# EAGLE design entree16_v1_4_4 (EAGLE 5.10)
DRILL: 1.6mm
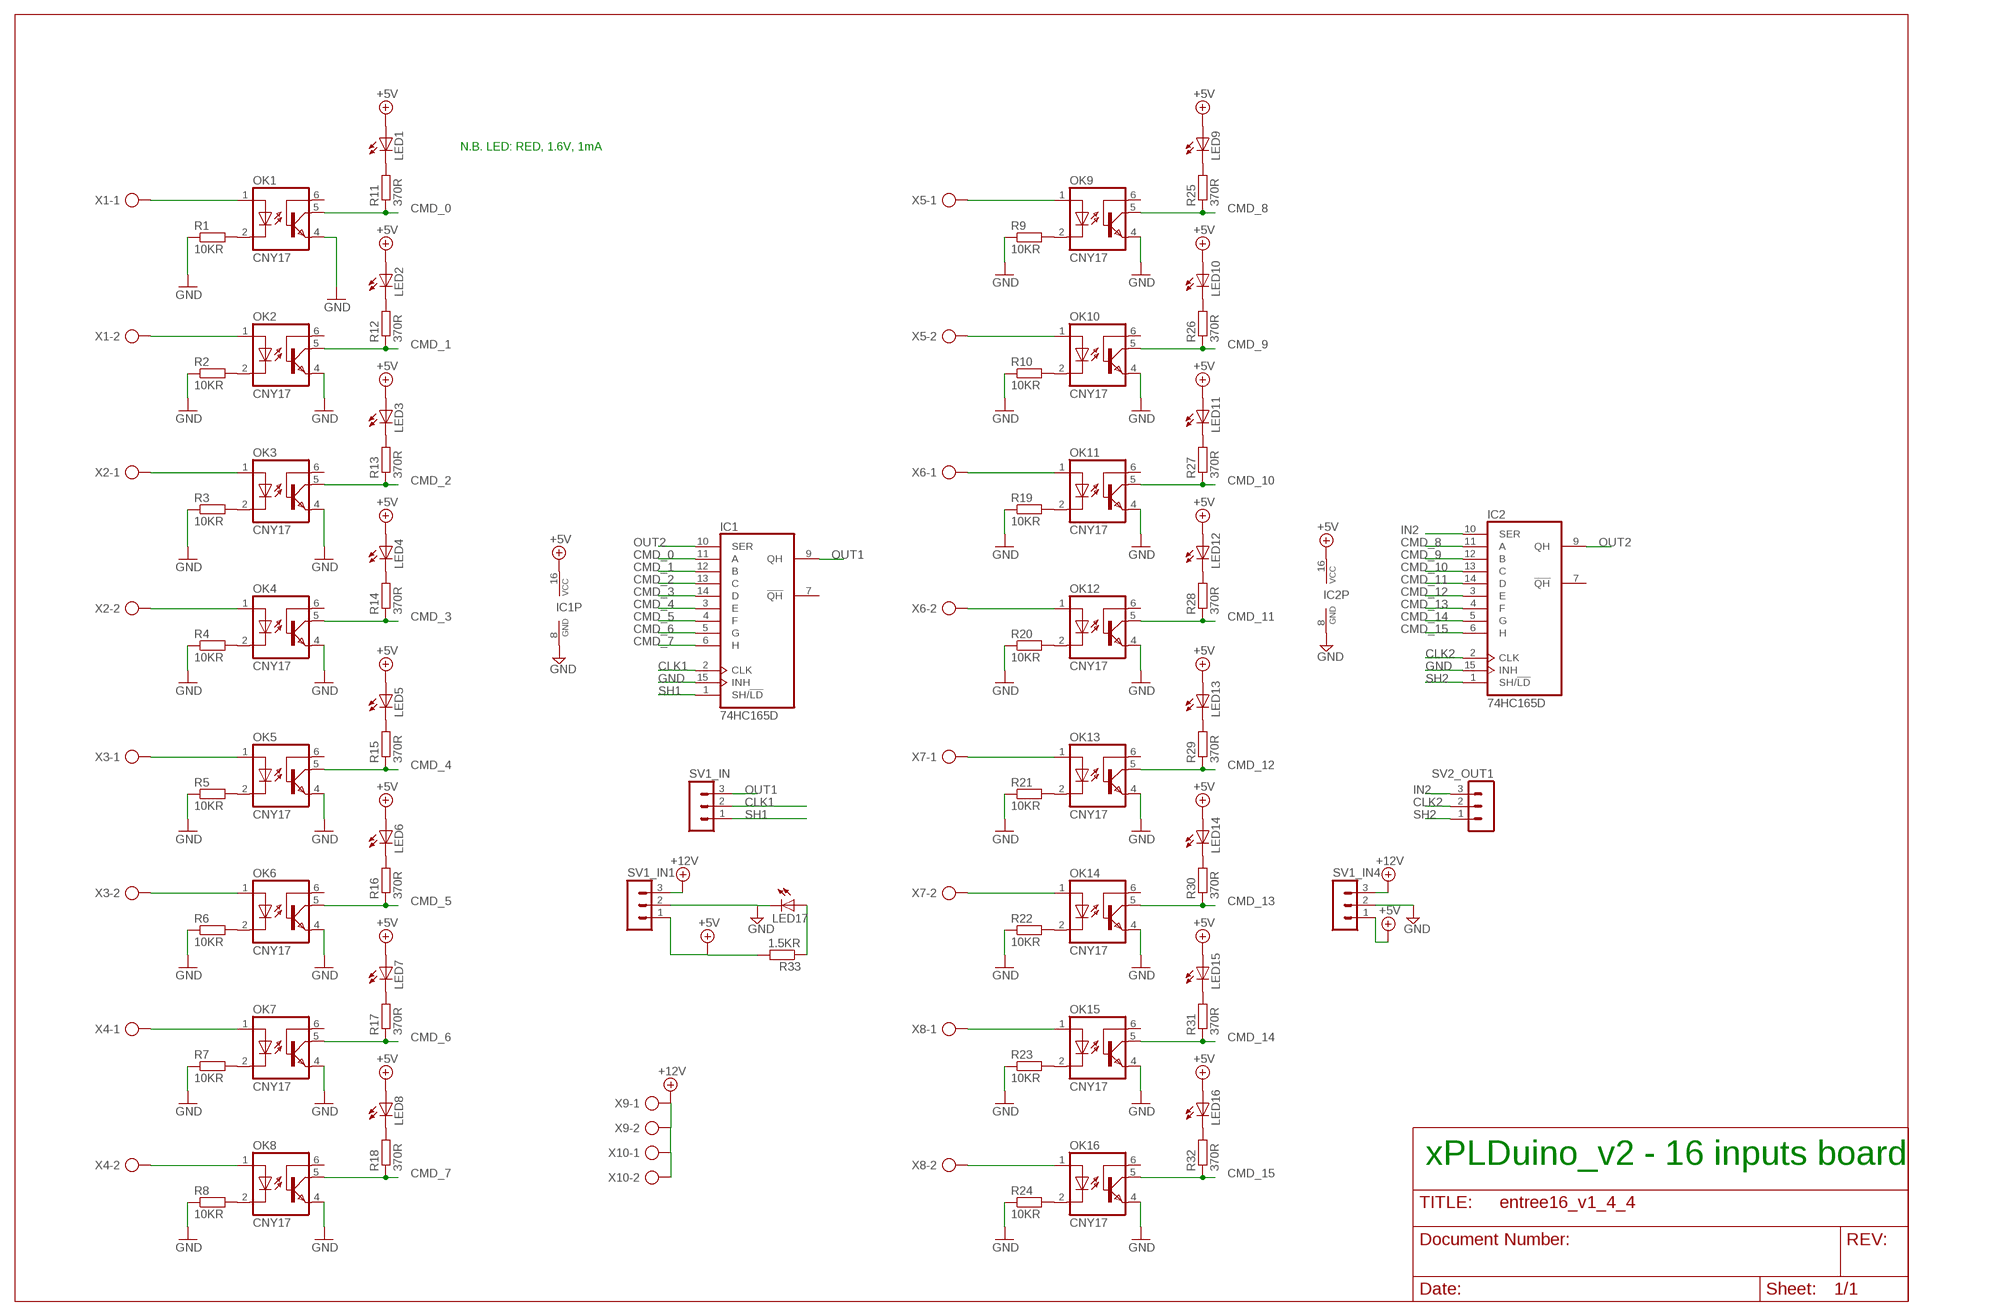
[diagram p0: schematic, sheet 1]

## Parts
IC1  74HC165D  [SO16]
IC2  74HC165D  [SO16]
LED1  LED3MM  [LED3MM]
LED2  LED3MM  [LED3MM]
LED3  LED3MM  [LED3MM]
LED4  LED3MM  [LED3MM]
LED5  LED3MM  [LED3MM]
LED6  LED3MM  [LED3MM]
LED7  LED3MM  [LED3MM]
LED8  LED3MM  [LED3MM]
LED9  LED3MM  [LED3MM]
LED10  LED3MM  [LED3MM]
LED11  LED3MM  [LED3MM]
LED12  LED3MM  [LED3MM]
LED13  LED3MM  [LED3MM]
LED14  LED3MM  [LED3MM]
LED15  LED3MM  [LED3MM]
LED16  LED3MM  [LED3MM]
LED17  LED3MM  [LED3MM]
OK1  CNY17  [DIL06]
OK2  CNY17  [DIL06]
OK3  CNY17  [DIL06]
OK4  CNY17  [DIL06]
OK5  CNY17  [DIL06]
OK6  CNY17  [DIL06]
OK7  CNY17  [DIL06]
OK8  CNY17  [DIL06]
OK9  CNY17  [DIL06]
OK10  CNY17  [DIL06]
OK11  CNY17  [DIL06]
OK12  CNY17  [DIL06]
OK13  CNY17  [DIL06]
OK14  CNY17  [DIL06]
OK15  CNY17  [DIL06]
OK16  CNY17  [DIL06]
R1  10KR  R-EU_0204/7  [0204/7]
R2  10KR  R-EU_0204/7  [0204/7]
R3  10KR  R-EU_0204/7  [0204/7]
R4  10KR  R-EU_0204/7  [0204/7]
R5  10KR  R-EU_0204/7  [0204/7]
R6  10KR  R-EU_0204/7  [0204/7]
R7  10KR  R-EU_0204/7  [0204/7]
R8  10KR  R-EU_0204/7  [0204/7]
R9  10KR  R-EU_0204/7  [0204/7]
R10  10KR  R-EU_0204/7  [0204/7]
R11  370R  R-EU_0204/7  [0204/7]
R12  370R  R-EU_0204/7  [0204/7]
R13  370R  R-EU_0204/7  [0204/7]
R14  370R  R-EU_0204/7  [0204/7]
R15  370R  R-EU_0204/7  [0204/7]
R16  370R  R-EU_0204/7  [0204/7]
R17  370R  R-EU_0204/7  [0204/7]
R18  370R  R-EU_0204/7  [0204/7]
R19  10KR  R-EU_0204/7  [0204/7]
R20  10KR  R-EU_0204/7  [0204/7]
R21  10KR  R-EU_0204/7  [0204/7]
R22  10KR  R-EU_0204/7  [0204/7]
R23  10KR  R-EU_0204/7  [0204/7]
R24  10KR  R-EU_0204/7  [0204/7]
R25  370R  R-EU_0204/7  [0204/7]
R26  370R  R-EU_0204/7  [0204/7]
R27  370R  R-EU_0204/7  [0204/7]
R28  370R  R-EU_0204/7  [0204/7]
R29  370R  R-EU_0204/7  [0204/7]
R30  370R  R-EU_0204/7  [0204/7]
R31  370R  R-EU_0204/7  [0204/7]
R32  370R  R-EU_0204/7  [0204/7]
R33  1.5KR  R-EU_0204/5  [0204/5]
SV1_IN  MA03-1  [MA03-1]
SV1_IN1  MA03-1  [MA03-1]
SV1_IN4  MA03-1  [MA03-1]
SV2_OUT1  MA03-1  [MA03-1]
X1  AK500/2-H  [AK500/2-H]
X2  AK500/2-H  [AK500/2-H]
X3  AK500/2-H  [AK500/2-H]
X4  AK500/2-H  [AK500/2-H]
X5  AK500/2-H  [AK500/2-H]
X6  AK500/2-H  [AK500/2-H]
X7  AK500/2-H  [AK500/2-H]
X8  AK500/2-H  [AK500/2-H]
X9  AK500/2-H  [AK500/2-H]
X10  AK500/2-H  [AK500/2-H]

## Nets
+5V: IC1.16(VCC) IC2.16(VCC) LED1.A LED2.A LED3.A LED4.A LED5.A LED6.A LED7.A LED8.A LED9.A LED10.A LED11.A LED12.A LED13.A LED14.A LED15.A LED16.A R33.2 SV1_IN1.1 SV1_IN4.1
+12V: SV1_IN1.3 SV1_IN4.3 X9.1 X9.2 X10.1 X10.2
CLK1: IC1.2(CLK) SV1_IN.2
CLK2: IC2.2(CLK) SV2_OUT1.2
CMD_0: IC1.11(A) OK1.5(COL) R11.1
CMD_1: IC1.12(B) OK2.5(COL) R12.1
CMD_2: IC1.13(C) OK3.5(COL) R13.1
CMD_3: IC1.14(D) OK4.5(COL) R14.1
CMD_4: IC1.3(E) OK5.5(COL) R15.1
CMD_5: IC1.4(F) OK6.5(COL) R16.1
CMD_6: IC1.5(G) OK7.5(COL) R17.1
CMD_7: IC1.6(H) OK8.5(COL) R18.1
CMD_8: IC2.11(A) OK9.5(COL) R25.1
CMD_9: IC2.12(B) OK10.5(COL) R26.1
CMD_10: IC2.13(C) OK11.5(COL) R27.1
CMD_11: IC2.14(D) OK12.5(COL) R28.1
CMD_12: IC2.3(E) OK13.5(COL) R29.1
CMD_13: IC2.4(F) OK14.5(COL) R30.1
CMD_14: IC2.5(G) OK15.5(COL) R31.1
CMD_15: IC2.6(H) OK16.5(COL) R32.1
GND: IC1.8(GND) IC1.15(INH) IC2.8(GND) IC2.15(INH) LED17.K(C) OK1.4(EMI) OK2.4(EMI) OK3.4(EMI) OK4.4(EMI) OK5.4(EMI) OK6.4(EMI) OK7.4(EMI) OK8.4(EMI) OK9.4(EMI) OK10.4(EMI) OK11.4(EMI) OK12.4(EMI) OK13.4(EMI) OK14.4(EMI) OK15.4(EMI) OK16.4(EMI) R1.1 R2.1 R3.1 R4.1 R5.1 R6.1 R7.1 R8.1 R9.1 R10.1 R19.1 R20.1 R21.1 R22.1 R23.1 R24.1 SV1_IN1.2 SV1_IN4.2
IN2: IC2.10(SER) SV2_OUT1.3
N$1: LED1.K(C) R11.2
N$2: LED2.K(C) R12.2
N$3: OK1.2(C) R1.2
N$4: OK2.2(C) R2.2
N$5: LED3.K(C) R13.2
N$6: LED4.K(C) R14.2
N$7: LED5.K(C) R15.2
N$8: LED6.K(C) R16.2
N$9: OK3.2(C) R3.2
N$10: OK8.1(A) X4.2
N$11: OK7.1(A) X4.1
N$12: OK4.2(C) R4.2
N$13: OK6.1(A) X3.2
N$14: OK5.1(A) X3.1
N$15: OK5.2(C) R5.2
N$16: OK6.2(C) R6.2
N$17: OK4.1(A) X2.2
N$18: OK3.1(A) X2.1
N$19: LED7.K(C) R17.2
N$20: OK2.1(A) X1.2
N$21: OK7.2(C) R7.2
N$22: OK8.2(C) R8.2
N$23: LED8.K(C) R18.2
N$24: OK1.1(A) X1.1
N$27: OK9.2(C) R9.2
N$28: OK10.2(C) R10.2
N$29: OK11.2(C) R19.2
N$30: OK12.2(C) R20.2
N$31: OK13.2(C) R21.2
N$32: OK14.2(C) R22.2
N$33: OK15.2(C) R23.2
N$34: OK16.2(C) R24.2
N$35: LED9.K(C) R25.2
N$36: LED10.K(C) R26.2
N$37: LED11.K(C) R27.2
N$38: LED12.K(C) R28.2
N$39: LED13.K(C) R29.2
N$40: LED14.K(C) R30.2
N$41: OK16.1(A) X8.2
N$42: OK15.1(A) X8.1
N$43: OK14.1(A) X7.2
N$44: OK13.1(A) X7.1
N$45: OK12.1(A) X6.2
N$46: OK11.1(A) X6.1
N$47: LED15.K(C) R31.2
N$48: OK10.1(A) X5.2
N$49: LED16.K(C) R32.2
N$50: OK9.1(A) X5.1
N$51: LED17.A R33.1
OUT1: IC1.9(QH) SV1_IN.3
OUT2: IC1.10(SER) IC2.9(QH)
SH1: IC1.1(SH/!LD) SV1_IN.1
SH2: IC2.1(SH/!LD) SV2_OUT1.1
Unconnected: IC1.7(!QH) IC2.7(!QH) OK1.6(BAS) OK2.6(BAS) OK3.6(BAS) OK4.6(BAS) OK5.6(BAS) OK6.6(BAS) OK7.6(BAS) OK8.6(BAS) OK9.6(BAS) OK10.6(BAS) OK11.6(BAS) OK12.6(BAS) OK13.6(BAS) OK14.6(BAS) OK15.6(BAS) OK16.6(BAS)

## Notes on the sheet
- N.B. LED: RED, 1.6V, 1mA
- xPLDuino_v2 - 16 inputs board

## Library data of the parts
IC1 IC2 = 74xx-eu:74*165: 8-bit parallel load SHIFT REGISTER
LED1-LED17 = led:LED: LED OSRAM: - CHIPLED LG R971, LG N971, LY N971, LG Q971, LY Q971, LO R971, LY R971 LH N974, LH R974 LS Q976, LO Q976, LY Q976 LO Q996 - Hyper CHIPLED LW Q18S LB Q993, LB Q99A, LB R99A - SideLED LS A670, LO A670, LY A670, LG A670, LP A670 LB A673, LV A673, LT A673, LW A673 LH A674 LY A675 LS A676, LA A676, LO A676, LY A676, LW A676 LS A679, LY A679, LG A679 - Hyper Micro SIDELED® LS Y876, LA Y876, LO Y876, LY Y876 LT Y87S - SmartLED LW L88C, LW L88S LB L89C, LB L89S, LG L890 LS L89K, LO L89K, LY L89K LS L896, LA L896, LO L896, LY L896 - TOPLED LS T670, LO T670, LY T670, LG T670, LP T670 LSG T670, LSP T670, LSY T670, LOP T670, LYG T670 LG T671, LOG T671, LSG T671 LB T673, LV T673, LT T673, LW T673 LH T674 LS T676, LA T676, LO T676, LY T676, LB T676, LH T676, LSB T676, LW T676 LB T67C, LV T67C, LT T67C, LS T67K, LO T67K, LY T67K, LW E67C LS E67B, LA E67B, LO E67B, LY E67B, LB E67C, LV E67C, LT E67C LW T67C LS T679, LY T679, LG T679 LS T770, LO T770, LY T770, LG T770, LP T770 LB T773, LV T773, LT T773, LW T773 LH T774 LS E675, LA E675, LY E675, LS T675 LS T776, LA T776, LO T776, LY T776, LB T776 LHGB T686 LT T68C, LB T68C - Hyper Mini TOPLED® LB M676 - Mini TOPLED Santana® LG M470 LS M47K, LO M47K, LY M47K Source: http://www.osram.convergy.de LUXEON: - LUMILED® LXK2-PW12-R00, LXK2-PW12-S00, LXK2-PW14-U00, LXK2-PW14-V00 LXK2-PM12-R00, LXK2-PM12-S00, LXK2-PM14-U00 LXK2-PE12-Q00, LXK2-PE12-R00, LXK2-PE12-S00, LXK2-PE14-T00, LXK2-PE14-U00 LXK2-PB12-K00, LXK2-PB12-L00, LXK2-PB12-M00, LXK2-PB14-N00, LXK2-PB14-P00, LXK2-PB14-Q00 LXK2-PR12-L00, LXK2-PR12-M00, LXK2-PR14-Q00, LXK2-PR14-R00 LXK2-PD12-Q00, LXK2-PD12-R00, LXK2-PD12-S00 LXK2-PH12-R00, LXK2-PH12-S00 LXK2-PL12-P00, LXK2-PL12-Q00, LXK2-PL12-R00 Source: www.luxeon.com KINGBRIGHT: KA-3528ASYC Source: www.kingbright.com
OK1-OK16 = optocoupler:CNY17: SIEMENS OPTO COUPLER
R1-R33 = resistor:R-EU_: RESISTOR, European symbol
SV1_IN SV1_IN1 SV1_IN4 SV2_OUT1 = con-lstb:MA03-1: PIN HEADER; OC_FARNELL: unknown; OC_NEWARK: unknown
X1-X10 = con-ptr500:AK500/2-H: CONNECTOR Aug. 2004 / PTR Meßtechnik: Die Bezeichnung der Serie AK505 wurde geändert. Es handelt sich hierbei um AK500 in horizontaler Ausführung.; OC_FARNELL: unknown; OC_NEWARK: unknown

## Net classes
1 puissance: width 0.254 mm, drill 0.61 mm

## Board
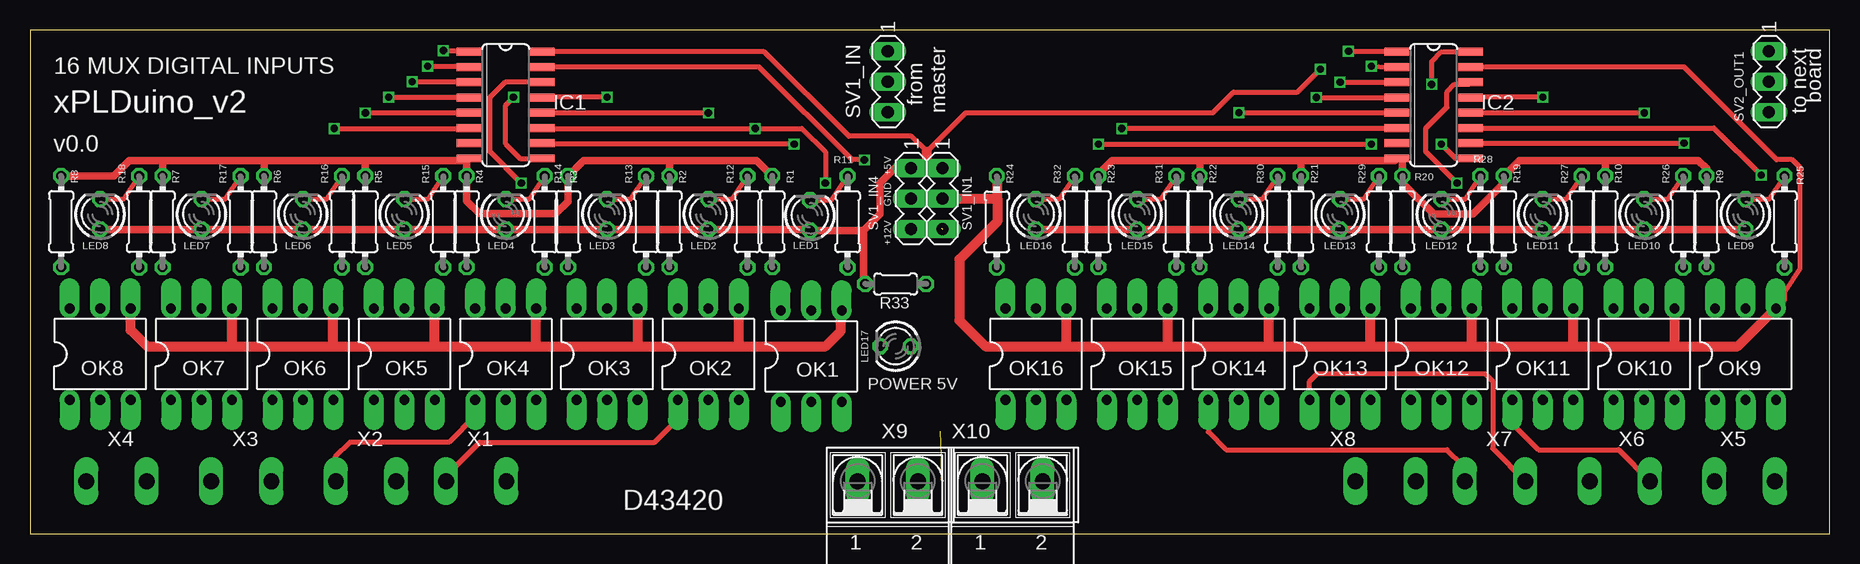
[diagram p1: board, top side]
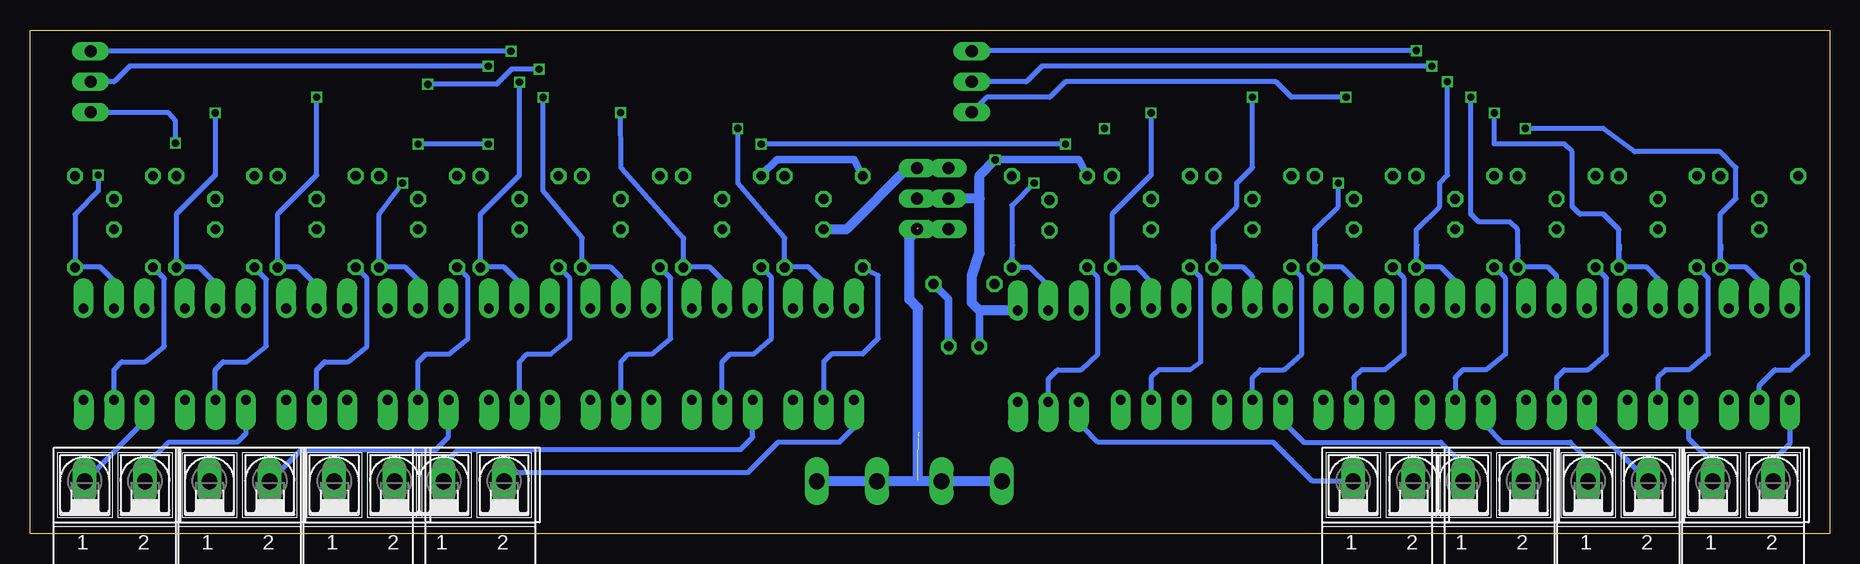
[diagram p2: board, bottom side, seen from below]

Size 150 x 42 mm. Coordinates in mm from the lower left corner, seen from the top.
Outline: 0,0 150,0 150,42 0,42 0,0
Copper layers (1*16): Top 0.035mm / dielectric 1.5mm / Bottom 0.035mm
Design rules "Fusion_eagle_rule_v1.1": minimum track width 6mil, minimum drill 12mil, track to track 6mil, track to pad 6mil, pad to pad 6mil, via to via 6mil, smd to smd 0mil, copper to edge 10mil, drill to drill 10mil, minimum pad ring 10mil, minimum via ring 6mil, stop-mask expansion 2mil, vias tented up to drill 100mil, thermal gap 10mil

### Footprints (pad centres in the part's own frame; a part is rotated, then mirrored left to right if it is on the bottom)
SO16 = smd 0.66 x 2.032: 1 -4.445,-3.073; 2 -3.175,-3.073; 3 -1.905,-3.073; 4 -0.635,-3.073; 5 0.635,-3.073; 6 1.905,-3.073; 7 3.175,-3.073; 8 4.445,-3.073; 9 4.445,3.073; 10 3.175,3.073; 11 1.905,3.073; 12 0.635,3.073; 13 -0.635,3.073; 14 -1.905,3.073; 15 -3.175,3.073; 16 -4.445,3.073
LED3MM = drill 0.813 octagon: A -1.27,0; K 1.27,0
DIL06 = drill 0.813 pad 1.676 offset: 1 -2.54,-3.81; 2 0,-3.81; 3 2.54,-3.81; 4 2.54,3.81; 5 0,3.81; 6 -2.54,3.81
0204/7 = drill 0.813 octagon: 1 -3.81,0; 2 3.81,0
0204/5 = drill 0.813 octagon: 1 -2.54,0; 2 2.54,0
MA03-1 = drill 1.016 long: 1 -2.54,0; 2 0,0; 3 2.54,0
AK500/2-H = drill 1.321 long: 1 -2.515,0; 2 2.515,0

### Placement (x,y rotation side)
IC1  39.65,35.73 270 top
IC2  117,35.73 270 top
LED1  65.02,26.55 90 top
LED2  56.55,26.64 90 top
LED3  48.1,26.64 90 top
LED4  39.65,26.64 90 top
LED5  31.2,26.64 90 top
LED6  22.75,26.64 90 top
LED7  14.3,26.64 90 top
LED8  5.85,26.64 90 top
LED9  143,26.64 90 top
LED10  134.55,26.64 90 top
LED11  126.1,26.64 90 top
LED12  117.65,26.64 90 top
LED13  109.2,26.64 90 top
LED14  100.75,26.64 90 top
LED15  92.3,26.64 90 top
LED16  83.85,26.64 90 top
LED17  72.15,15.62 180 top
OK1  65.12,14.79 0 top
OK2  56.55,14.96 0 top
OK3  48.1,14.96 0 top
OK4  39.65,14.96 0 top
OK5  31.2,14.96 0 top
OK6  22.75,14.96 0 top
OK7  14.3,14.96 0 top
OK8  5.85,14.96 0 top
OK9  143,14.96 0 top
OK10  134.55,14.96 0 top
OK11  126.1,14.96 0 top
OK12  117.65,14.96 0 top
OK13  109.2,14.96 0 top
OK14  100.75,14.96 0 top
OK15  92.3,14.96 0 top
OK16  83.85,14.96 0 top
R1  61.87,26.02 270 top
R2  53.3,26.02 270 top
R3  44.85,26.02 270 top
R4  36.4,26.02 270 top
R5  27.95,26.02 270 top
R6  19.5,26.02 270 top
R7  11.05,26.02 270 top
R8  2.6,26.02 270 top
R9  139.75,26.02 270 top
R10  131.3,26.02 270 top
R11  68.16,26 90 top
R12  59.8,26 90 top
R13  51.35,26 90 top
R14  42.9,26 90 top
R15  34.45,26 90 top
R16  26,26 90 top
R17  17.55,26 90 top
R18  9.1,26 90 top
R19  122.85,26.02 270 top
R20  114.4,26.02 270 top
R21  105.95,26.02 270 top
R22  97.5,26.02 270 top
R23  89.05,26.02 270 top
R24  80.58,26 270 top
R25  146.25,26 90 top
R26  137.8,26 90 top
R27  129.35,26 90 top
R28  120.9,26 90 top
R29  112.45,26 90 top
R30  104,26 90 top
R31  95.55,26 90 top
R32  87.1,26 90 top
R33  72.15,20.82 180 top
SV1_IN  71.5,37.69 270 top
SV1_IN1  76.05,27.93 270 top
SV1_IN4  73.45,27.93 270 top
SV2_OUT1  144.95,37.69 270 top
X1  37.19,4.37 0 bottom
X2  28.01,4.37 0 bottom
X3  17.61,4.37 0 bottom
X4  7.21,4.37 0 bottom
X5  142.93,4.37 0 bottom
X6  132.53,4.37 0 bottom
X7  122.12,4.37 0 bottom
X8  113,4.37 0 bottom
X9  71.5,4.37 0 top
X10  81.9,4.37 0 top

### Tracks (layer width: path | path; a pad name or v marks a point on that pad's centre or on a via)
+5V  (via drill 0.6)
  Top 0.406: IC1.16 61.2,40.18 68.25,33.13 73.45,33.13 74.75,31.84 78,35.09 98.58,35.09 100.33,36.83 105.66,36.83 v107.56,38.73 | IC2.16 117.65,40.18 116.84,39.37 v116.84,37.47
  Top 0.61: 69.49,25.27 LED1.A arc90 64.93,25.36 LED2.A LED3.A LED4.A LED5.A LED6.A LED7.A LED8.A | 69.49,25.27 70.85,26.64 70.85,29.23 72.15,30.54 73.39,30.54 SV1_IN4.1 | SV1_IN1.1 76.11,30.54 | 69.49,25.27 69.49,20.93 R33.2 | LED16.A LED15.A LED14.A LED13.A LED12.A LED11.A LED10.A LED9.A
  Top 0.813: SV1_IN4.1 74.75,30.48 | 74.75,30.48 SV1_IN1.1 | 74.75,30.48 74.75,31.84
  Bottom 0.406: v107.56,38.73 109.86,38.73 111.12,37.47 v116.84,37.47
  Bottom 0.813: LED16.A 81.95,25.36 76.83,30.48 SV1_IN1.1
+12V  (3 unrouted)
  Bottom 0.61: 76.05,4.37 75.97,4.45
  Bottom 0.813: X9.1 X9.2 76.05,4.37 X10.1 X10.2 | SV1_IN4.3 SV1_IN1.3 | 75.97,25.48 75.97,25.42 76.7,24.68 76.7,19.52 75.97,18.78 75.97,4.45
CLK1  (via drill 0.6)
  Top 0.406: v33.15,38.98 36.5,38.98 IC1.2
  Bottom 0.406: v33.15,38.98 65.65,38.98 66.95,37.69 SV1_IN.2
CLK2  (via drill 0.6)
  Top 0.406: IC2.2 113.17,38.91 v111.8,38.98
  Bottom 0.406: v111.8,38.98 141.7,38.98 143,37.69 SV2_OUT1.2
CMD_0  (via drill 0.6)
  Top 0.406: v66.3,29.23 66.3,31.84 64.35,33.78 v60.45,33.78 42.77,33.78 IC1.11
  Bottom 0.406: 66.3,29.09 v66.3,29.23 68.16,27.38 R11.1 | R11.1 68.1,24.04 | OK1.5 65.12,20.67 66.67,22.23 68.12,22.23 R11.1
CMD_1  (via drill 0.6)
  Top 0.406: v56.55,35.09 42.74,35.09 IC1.12
  Bottom 0.406: v56.55,35.09 56.55,29.89 59.8,26.64 R12.1 57.75,22.19 56.52,20.95 56.52,18.81 OK2.5
CMD_2  (via drill 0.6)
  Top 0.406: v48.1,36.38 42.74,36.38 IC1.13
  Bottom 0.406: R13.1 51.35,25.34 49.4,27.29 49.4,29.23 48.1,30.54 v48.1,36.38 | R13.1 51.29,24.04 | OK3.5 48.1,21.43 48.9,22.23 51.31,22.23 R13.1
CMD_3  (via drill 0.6)
  Top 0.406: IC1.14 42.68,37.69 39.65,37.69 38.35,36.38 38.35,31.84 v40.95,29.23
  Bottom 0.406: R14.1 42.9,25.34 40.95,27.29 v40.95,29.23 | R14.1 42.84,24.04 | OK4.5 39.65,21.23 40.64,22.23 42.87,22.23 R14.1
CMD_4  (via drill 0.6)
  Top 0.406: v31.85,37.69 36.53,37.69 IC1.3
  Bottom 0.406: R15.1 34.45,25.34 32.5,27.29 32.5,29.23 31.85,29.89 v31.85,37.69 | R15.1 34.39,24.04 | OK5.5 31.2,21.04 32.38,22.23 34.41,22.23 R15.1
CMD_5  (via drill 0.6)
  Top 0.406: v29.9,36.38 36.56,36.38 IC1.4
  Bottom 0.406: v29.9,36.38 29.9,26.64 29.25,25.98 26.65,25.98 26,25.34 R16.1 | R16.1 25.94,24.04 | OK6.5 22.75,21.48 23.5,22.23 25.96,22.23 R16.1
CMD_6  (via drill 0.6)
  Top 0.406: v27.95,35.09 36.58,35.09 IC1.5
  Bottom 0.406: R17.1 17.55,25.34 18.85,26.64 20.8,26.64 21.45,27.29 21.45,31.84 22.1,32.48 27.95,32.48 v27.95,35.09 | R17.1 17.49,24.04 | OK7.5 14.3,21.29 15.24,22.23 17.52,22.23 R17.1
CMD_7  (via drill 0.6)
  Top 0.406: v25.35,33.78 36.53,33.78 IC1.6
  Bottom 0.406: R18.1 9.1,26.64 7.8,27.93 7.8,30.54 9.1,31.84 16.25,31.84 18.85,33.78 v25.35,33.78 | R18.1 9.04,24.04 | OK8.5 5.85,21.09 6.99,22.23 9.06,22.23 R18.1
CMD_8  (via drill 0.6)
  Top 0.406: IC2.11 140.35,33.83 v144.3,29.89
  Bottom 0.406: v144.3,29.89 144.3,28.59 146.25,26.64 R25.1 146.22,22.23 144.15,22.23 143,21.08 OK9.5
CMD_9  (via drill 0.6)
  Top 0.406: v134.55,35.09 120.09,35.09 IC2.12
  Bottom 0.406: v134.55,35.09 134.55,29.89 137.8,26.64 R26.1 137.76,22.23 135.89,22.23 134.55,20.89 OK10.5
CMD_10  (via drill 0.6)
  Top 0.406: v126.1,36.38 120.06,36.38 | 120.06,36.38 119.6,36.38 | 120.06,36.38 IC2.13
  Bottom 0.406: v126.1,36.38 126.1,29.89 129.35,26.64 R27.1 129.31,22.23 127.64,22.23 126.1,20.69 OK11.5
CMD_11  (via drill 0.6)
  Top 0.406: v118.95,29.23 116.35,31.84 116.35,33.8 118.11,35.56 118.11,36.83 118.75,37.47 119.9,37.47 IC2.14 120.03,37.69
  Bottom 0.406: v118.95,29.23 120.9,26.64 R28.1 120.86,22.23 118.75,22.23 117.65,21.13 OK12.5
CMD_12  (via drill 0.6)
  Top 0.406: v109.2,37.64 IC2.3
  Bottom 0.406: v109.2,37.64 109.2,29.89 112.45,26.64 R29.1 112.42,22.23 110.49,22.23 109.2,20.93 OK13.5
CMD_13  (via drill 0.6)
  Top 0.406: v107.23,36.37 IC2.4
  Bottom 0.406: v107.23,36.37 107.25,31.18 107.25,28.59 104,24.68 103.97,24.65 103.97,22.23 | OK14.5 100.75,21.38 101.6,22.23 103.97,22.23 | 103.97,22.23 R30.1
CMD_14  (via drill 0.6)
  Top 0.406: v100.77,35.1 IC2.5
  Bottom 0.406: v100.77,35.1 100.75,31.18 100.75,30.54 95.55,24.68 95.52,24.65 95.52,22.23 | OK15.5 92.3,21.18 93.34,22.23 95.52,22.23 | 95.52,22.23 R31.1
CMD_15  (via drill 0.6)
  Top 0.406: IC2.6 91.05,33.83 v91,33.78
  Bottom 0.406: v91,33.78 91,29.23 87.1,24.68 R32.1 87.06,22.23 85.09,22.23 83.85,20.98 OK16.5
GND  (via drill 0.6)
  Top 0.406: IC2.15 137.88,38.91 145.6,31.18 146.9,31.18 147.55,30.54 147.55,22.1 146.25,20.16 146.25,19.48 OK9.4 145.6,18.84 | IC1.8 36.51,31.29 | v69.55,31.17 68.53,31.17 60.78,38.91 IC1.15
  Top 0.61: R19.1 122.85,29.89 | R19.1 122.85,29.23 120.25,26.64 117,26.64 114.4,29.23 R20.1 114.4,31.29 IC2.8 113.75,31.11 105.95,31.11 | R8.1 6.96,29.82 8.26,31.11 11.05,31.11 | 19.68,31.11 11.05,31.11 | 27.94,31.11 19.68,31.11 | 27.94,31.11 36.4,31.11 IC1.8 36.4,31.11 R4.1 36.4,27.73 37.47,26.67 43.81,26.67 44.85,27.7 R3.1 46.14,31.11 53.34,31.11 | R5.1 27.95,31.11 27.94,31.11 | R6.1 19.5,30.93 19.68,31.11 | 11.05,31.11 R7.1 | 53.34,31.11 60.58,31.11 R1.1 | R2.1 53.3,31.07 53.34,31.11 | R23.1 89.05,30 90.17,31.11 97.5,31.11 | 97.5,31.11 R22.1 | 97.5,31.11 105.95,31.11 | 105.95,31.11 R21.1 | R9.1 139.75,30.43 139.06,31.11 131.44,31.11 | 131.44,31.11 124.14,31.11 R19.1 | R10.1 131.3,30.97 131.44,31.11
  Top 0.813: OK3.4 50.7,18.71 50.7,15.62 | 50.7,15.62 59.15,15.62 | 59.15,15.62 66.3,15.62 67.6,16.91 67.6,18.54 OK1.4 | OK2.4 59.09,15.68 59.15,15.62 | OK8.4 8.39,16.98 9.75,15.62 16.9,15.62 | 16.9,15.62 25.35,15.62 | 25.35,15.62 33.8,15.62 | 33.8,15.62 42.25,15.62 | 42.25,15.62 50.7,15.62 | OK7.4 16.84,15.68 16.9,15.62 | OK6.4 25.29,15.68 25.35,15.62 | OK5.4 33.74,15.68 33.8,15.62 | OK4.4 42.19,15.68 42.25,15.62 | OK9.4 145.51,18.77 142.35,15.62 137.15,15.62 | 86.45,15.62 94.9,15.62 | 94.9,15.62 103.35,15.62 | 103.35,15.62 111.8,15.62 | 111.8,15.62 120.25,15.62 | 120.25,15.62 128.7,15.62 | 128.7,15.62 137.15,15.62 | OK16.4 86.39,15.68 86.45,15.62 | OK15.4 94.84,15.68 94.9,15.62 | OK14.4 103.29,15.68 103.35,15.62 | OK13.4 111.74,15.68 111.8,15.62 | OK12.4 120.19,15.68 120.25,15.62 | OK11.4 128.64,15.68 128.7,15.62 | OK10.4 137.09,15.68 137.15,15.62 | 86.45,15.62 79.64,15.62 77.47,17.78 77.47,22.86 80.64,26.04 80.64,27.94 | 80.64,27.94 80.64,29.75 R24.1 | SV1_IN1.2 80.64,27.93 80.64,27.94
  Bottom 0.61: v69.55,31.17 62.58,31.17 R1.1 | R23.1 89.05,29.89 87.75,31.18 81.33,31.18 R24.1 | 70.85,18.59 70.85,15.64
  Bottom 0.813: OK1.4 70.85,18.59 71.5,19.25 71.5,21.46 70.85,23.39 70.85,27.93 | 70.85,27.93 SV1_IN4.2 SV1_IN1.2 | 70.85,15.64 LED17.K | 70.85,27.93 70.85,29.87 v69.55,31.17
IN2  (via drill 0.6)
  Top 0.406: IC2.10 v137.88,32.56
  Bottom 0.406: v137.88,32.56 137.88,34.44 138.45,35.09 144.89,35.09 SV2_OUT1.3
N$1
  Top 0.406: LED1.K 66.8,27.82 R11.2
N$2
  Top 0.406: LED2.K 58.53,27.91 R12.2
N$3
  Bottom 0.406: OK1.2 65.12,12.89 64.35,13.66 62.4,13.66 61,14.96 61,21.34 R1.2
N$4
  Bottom 0.406: OK2.2 56.55,13.02 55.9,13.66 53.3,13.66 52.4,14.31 52.4,21.3 R2.2
N$5
  Top 0.406: LED3.K 50.08,27.91 R13.2
N$6
  Top 0.406: LED4.K 41.63,27.91 R14.2
N$7
  Top 0.406: LED5.K 33.18,27.91 R15.2
N$8
  Top 0.406: LED6.K 24.73,27.91 R16.2
N$9
  Bottom 0.406: OK3.2 48.1,13.02 47.45,13.66 45.5,13.66 44,14.96 44,21.36 R3.2
N$10
  Bottom 0.406: OK8.1 3.31,7.49 4.45,6.35 4.45,4.62 X4.2
N$11
  Bottom 0.406: OK7.1 11.76,7.95 9.53,5.71 9.53,4.57 X4.1
N$12
  Bottom 0.406: OK4.2 39.65,13.02 39,13.66 37.05,13.66 35.45,14.96 35.45,21.25 R4.2
N$13
  Bottom 0.406: OK6.1 20.21,9.48 X3.2
N$14
  Bottom 0.406: OK5.1 28.66,8.97 27.3,7.62 21.59,7.62 20.32,6.35 20.32,4.56 X3.1
N$15
  Bottom 0.406: OK5.2 31.2,13.02 30.55,13.66 28.6,13.66 27,14.96 27,21.25 R5.2
N$16
  Bottom 0.406: OK6.2 22.75,13.02 22.1,13.66 20.15,13.66 18.6,14.96 18.6,21.3 R6.2
N$17
  Top 0.406: OK4.1 37.11,9.8 34.92,7.62 26.67,7.62 25.4,6.35 25.4,4.46 X2.2
N$18
  Bottom 0.406: OK3.1 45.56,9.37 43.81,7.62 32.38,7.62 30.48,5.71 30.48,4.41 X2.1
N$19
  Top 0.406: LED7.K 16.28,27.91 R17.2
N$20
  Top 0.406: OK2.1 54.01,9.56 52.07,7.62 37.47,7.62 34.92,5.08 34.92,4.62 X1.2
N$21
  Bottom 0.406: OK7.2 14.3,13.02 13.65,13.66 11.7,13.66 10.1,14.96 10.1,21.25 R7.2
N$22
  Bottom 0.406: OK8.2 5.85,12.37 4.55,13.66 3.25,13.66 2.92,13.99 1.8,14.96 1.8,21.41 R8.2
N$23
  Top 0.406: LED8.K 7.83,27.91 R18.2
N$24
  Bottom 0.406: X1.1 43.1,4.37 46.35,7.62 60.96,7.62 62.23,8.89 62.23,10.62 OK1.1
N$27
  Bottom 0.406: OK9.2 143,13.66 142.35,14.31 140.4,14.31 138.8,15.62 138.8,21.25 R9.2
N$28
  Bottom 0.406: OK10.2 134.55,13.66 133.9,14.31 131.95,14.31 130.3,15.62 130.3,21.2 R10.2
N$29
  Bottom 0.406: OK11.2 126.1,13.66 125.45,14.31 123.5,14.31 121.9,15.62 121.9,21.25 R19.2
N$30
  Bottom 0.406: OK12.2 117.65,14.31 117,14.96 115.05,14.96 113.5,16.27 113.5,21.3 R20.2
N$31
  Bottom 0.406: OK13.2 109.2,14.31 108.55,14.96 106.6,14.96 105,16.27 105,21.25 R21.2
N$32
  Bottom 0.406: OK14.2 100.75,14.31 100.1,14.96 98.15,14.96 96.6,16.27 96.6,21.3 R22.2
N$33
  Bottom 0.406: OK15.2 92.3,14.31 91.65,14.96 89.7,14.96 88.2,16.27 88.2,21.36 R23.2
N$34
  Bottom 0.406: OK16.2 83.85,14.31 83.2,14.96 80.6,14.96 79.3,16.27 79.3,21.54 R24.2
N$35
  Top 0.406: LED9.K 144.98,27.91 R25.2
N$36
  Top 0.406: LED10.K 136.53,27.91 R26.2
N$37
  Top 0.406: LED11.K 128.08,27.91 R27.2
N$38
  Top 0.406: LED12.K 119.63,27.91 R28.2
N$39
  Top 0.406: LED13.K 111.18,27.91 R29.2
N$40
  Top 0.406: LED14.K 102.73,27.91 R30.2
N$41
  Bottom 0.406: OK16.1 81.31,8.86 82.55,7.62 87.63,7.62 90.17,5.08 109.77,5.08 X8.2
N$42
  Bottom 0.406: OK15.1 89.76,8.03 90.81,6.99 114.3,6.99 115.57,5.71 115.57,4.42 X8.1
N$43
  Top 0.406: OK14.1 98.21,8.47 99.69,6.99 118.11,6.99 119.38,5.71 119.38,4.59 X7.2
N$44
  Top 0.406: OK13.1 106.66,12.68 107.31,13.34 121.28,13.34 121.92,12.7 121.92,7.08 X7.1
N$45
  Bottom 0.406: OK12.1 115.11,8.08 116.2,6.99 127.39,6.99 X6.2
N$46
  Top 0.406: OK11.1 123.56,9.15 125.73,6.99 132.42,6.99 X6.1
N$47
  Top 0.406: LED15.K 94.28,27.91 R31.2
N$48
  Bottom 0.406: OK10.1 132.01,8.32 132.72,7.62 138.43,7.62 140.34,5.71 140.34,4.44 X5.2
N$49
  Top 0.406: LED16.K 85.83,27.91 R32.2
N$50
  Bottom 0.406: OK9.1 140.46,9.35 X5.1
N$51
  Bottom 0.61: LED17.A 73.42,19.55 R33.1
OUT1  (via drill 0.6)
  Top 0.406: v40.3,36.38 39.65,35.73 39.65,32.48 40.84,31.29 IC1.9
  Bottom 0.406: v40.3,36.38 44.85,36.38 46.15,37.69 63.7,37.69 65,36.38 70.26,36.38 SV1_IN.3
OUT2  (via drill 0.6)
  Top 0.406: IC2.9 118.84,31.29 v117.65,32.48 | v89.05,32.48 v111.8,32.48 | v63.7,32.48 42.8,32.48 IC1.10
  Bottom 0.406: v111.8,32.48 v117.65,32.48 | v63.7,32.48 v89.05,32.48
SH1  (via drill 0.6)
  Top 0.406: 35.75,40.28 35.65,40.18 | 35.75,40.28 36.47,40.28 IC1.1 | v34.45,40.28 35.75,40.28
  Bottom 0.406: v34.45,40.28 71.44,40.28 SV1_IN.1
SH2  (via drill 0.6)
  Top 0.406: 113.82,40.28 IC2.1 113.88,40.23 v109.91,40.23
  Bottom 0.406: v109.91,40.23 SV2_OUT1.1

### Text on the board
tNames: to next | board | 16 MUX DIGITAL INPUTS | from | xPLDuino_v2 | master | v0.0 | +5V | GND | +12V | POWER 5V | D43420